# EAGLE design ionode (EAGLE 7.3.0)
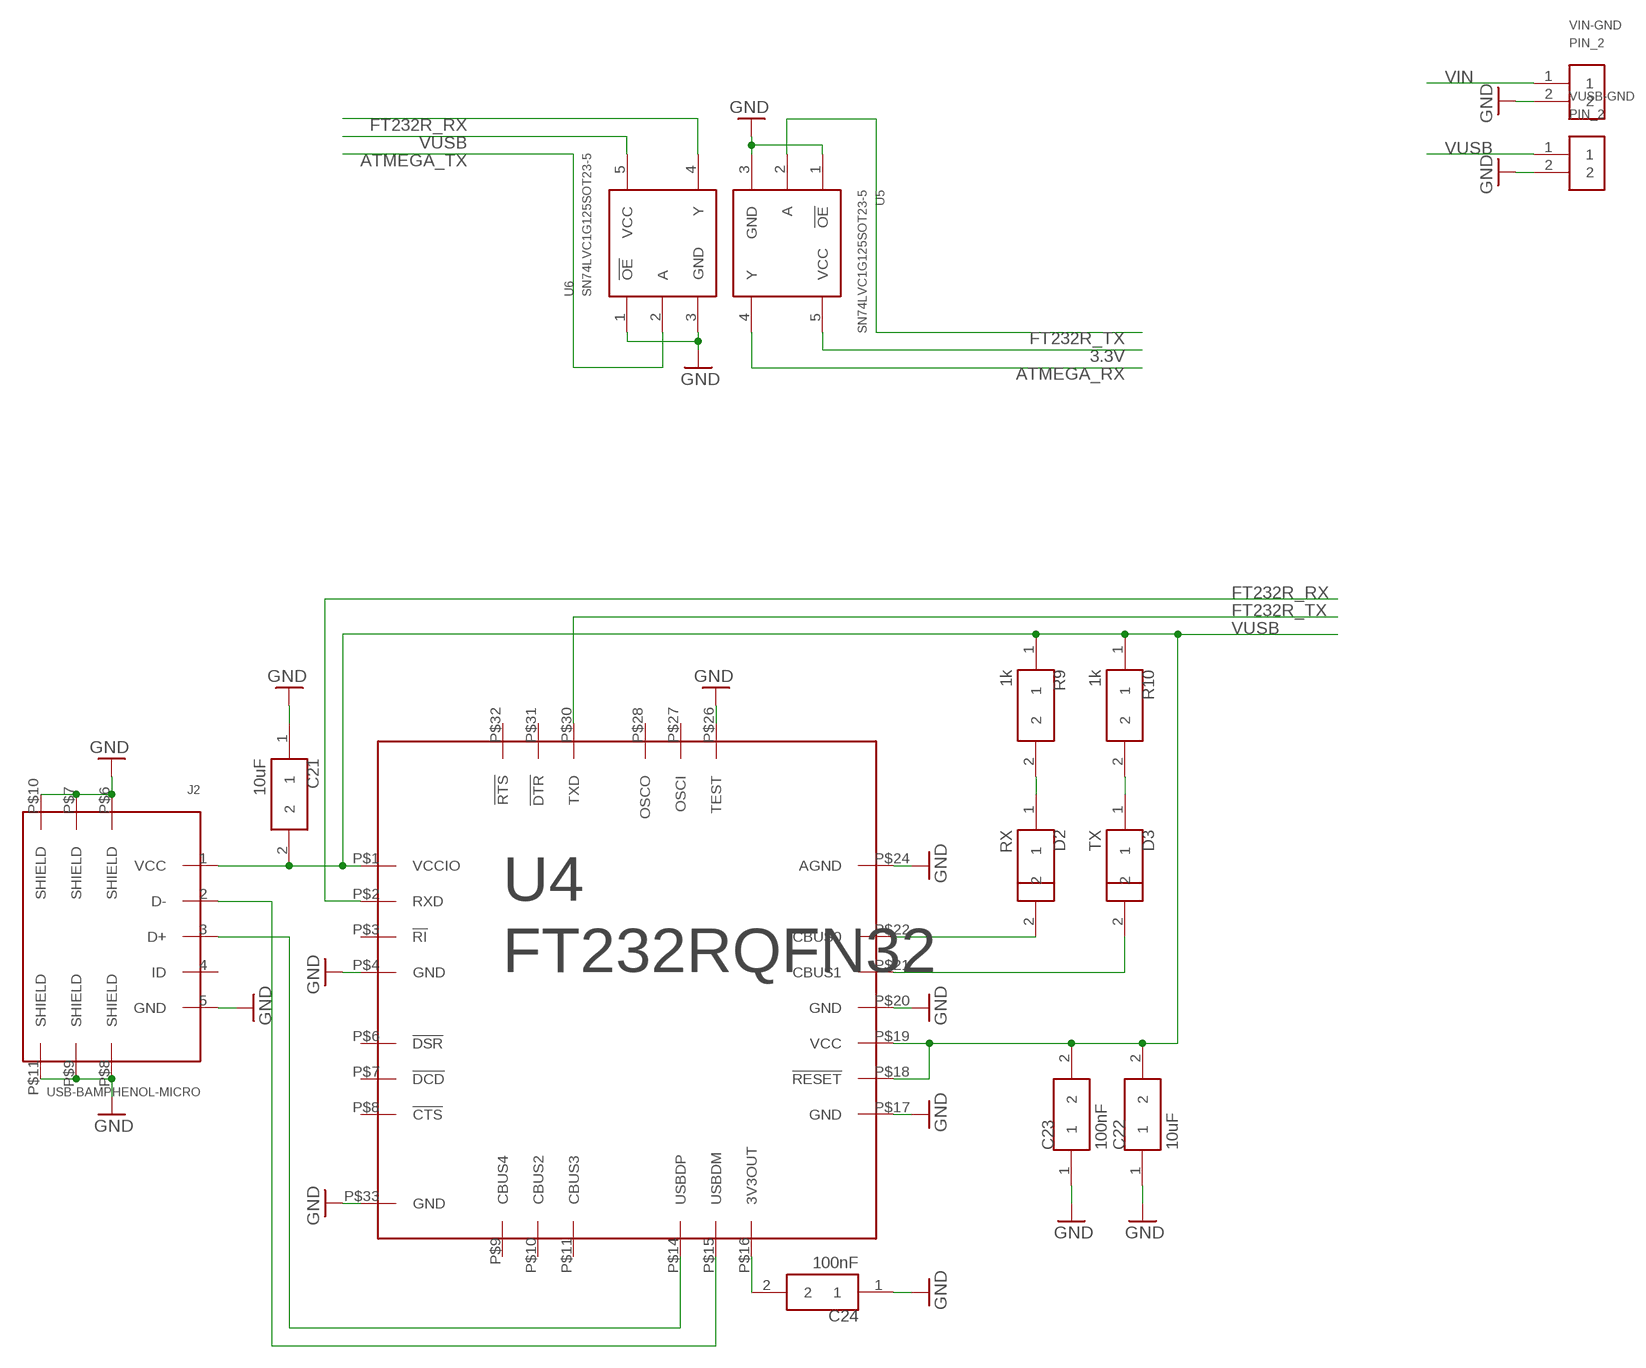
[diagram p0: schematic, sheet 1, part 1 of 2]
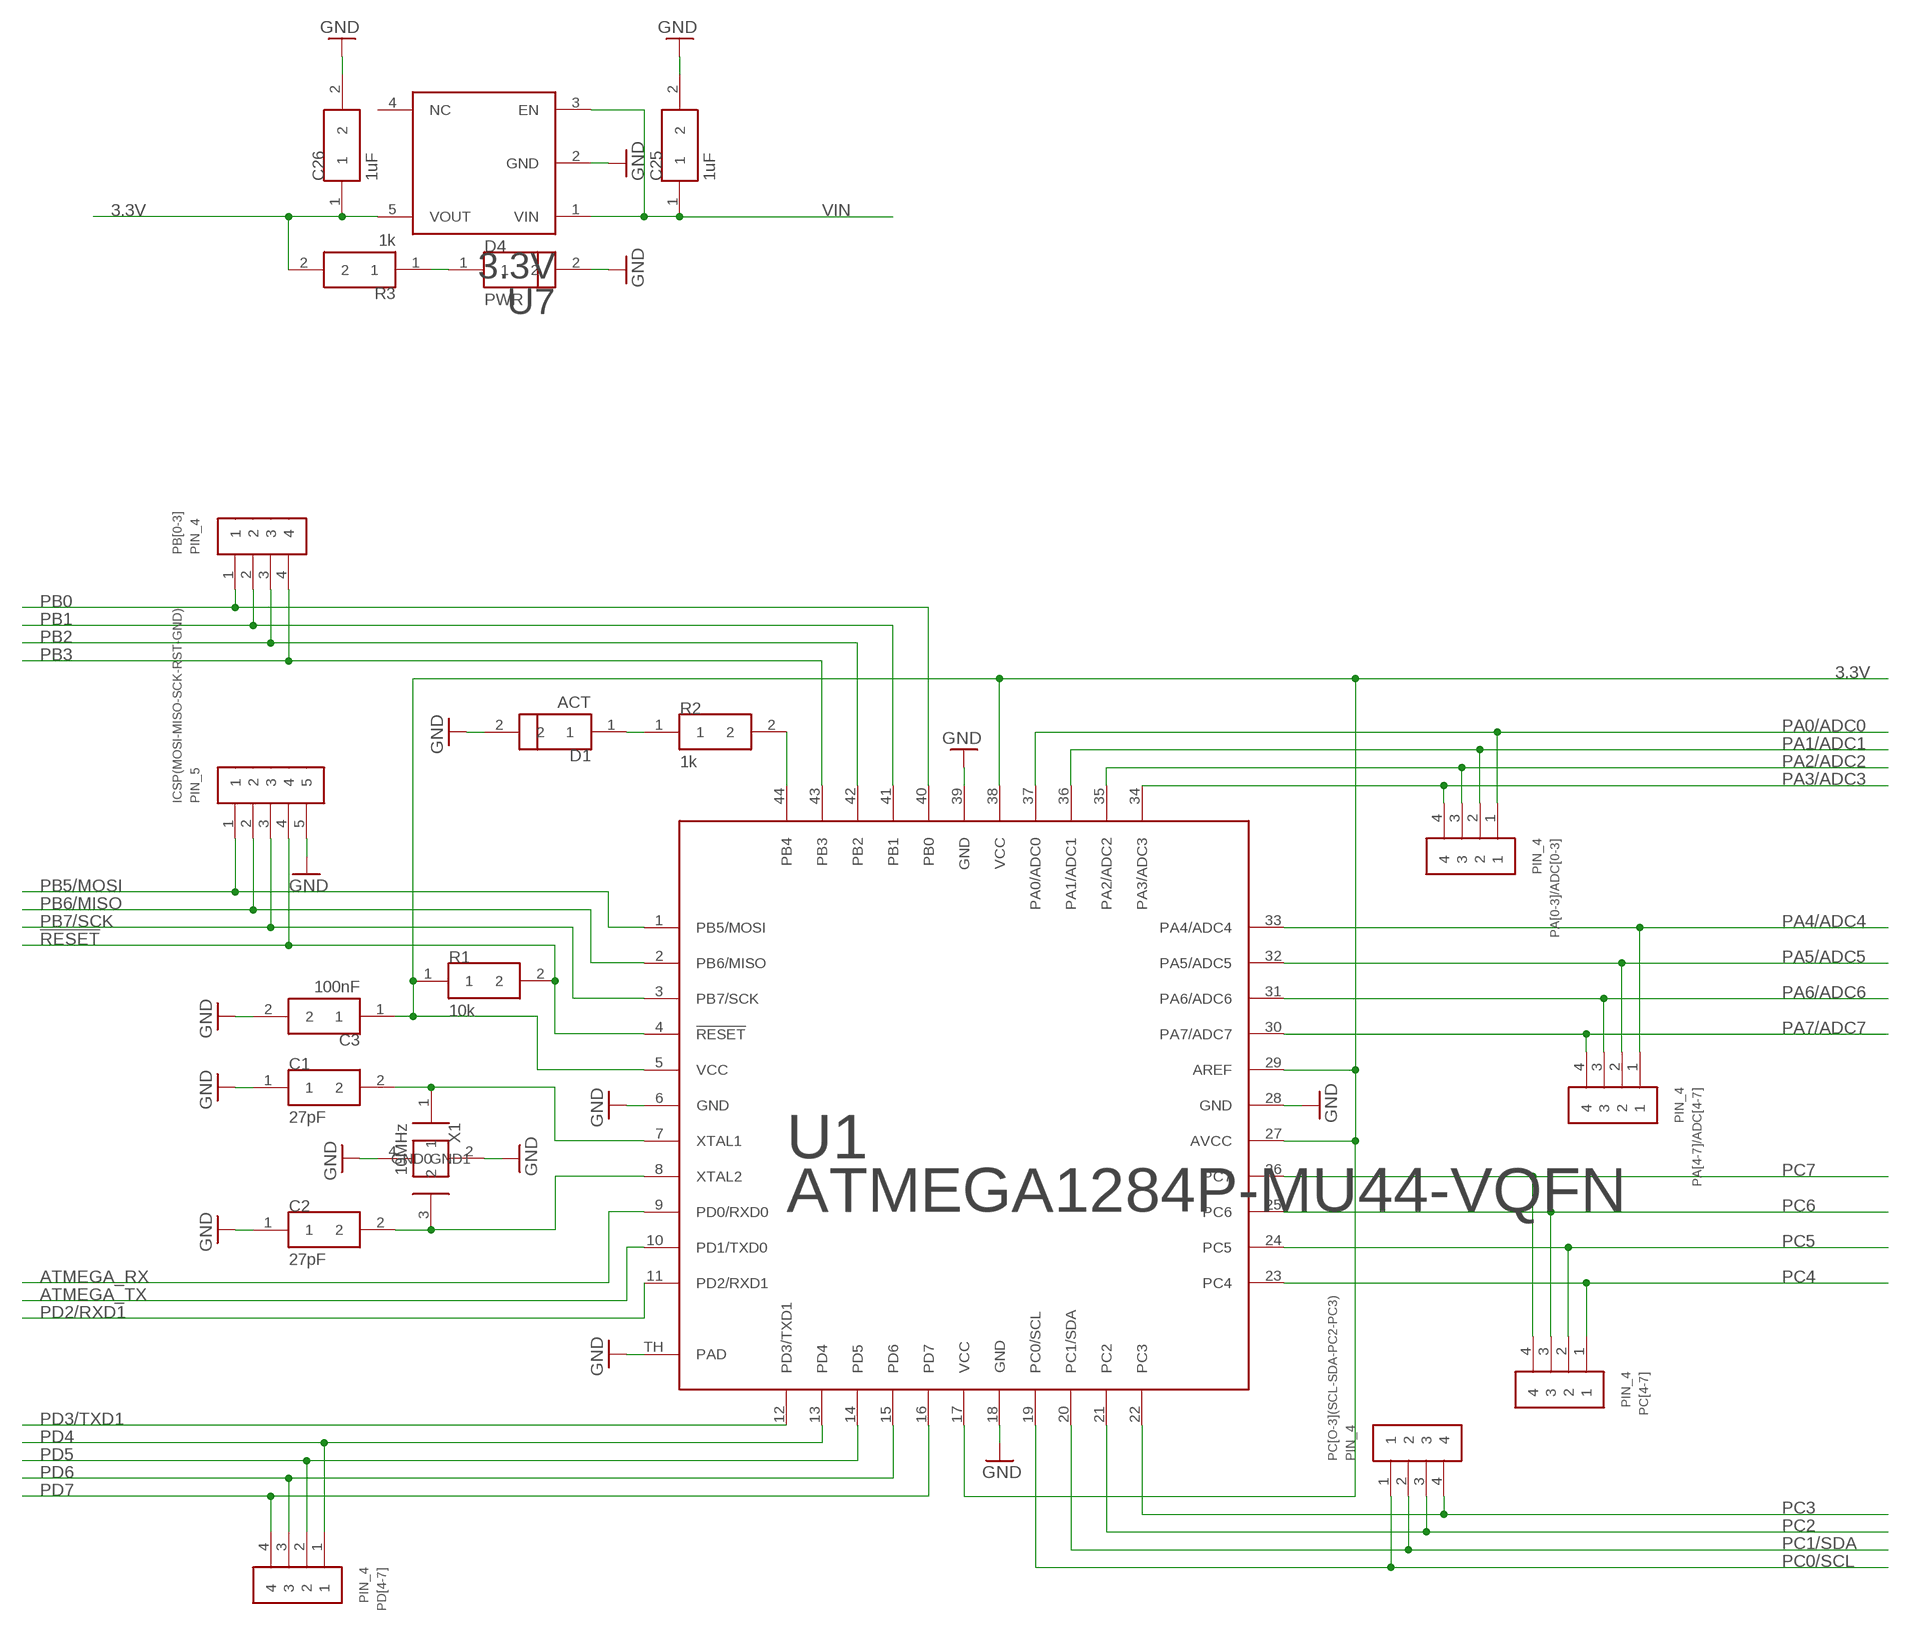
[diagram p1: schematic, sheet 1, part 2 of 2]

## Parts
C1  27pF  CAP0805  [0805]
C2  27pF  CAP0805  [0805]
C3  100nF  CAP0805  [0805]
C21  10uF  CAP0805  [0805]
C22  10uF  CAP0805  [0805]
C23  100nF  CAP0805  [0805]
C24  100nF  CAP0805  [0805]
C25  1uF  CAP0805  [0805]
C26  1uF  CAP0805  [0805]
D1  ACT  LED0805  [0805]
D2  RX  LED0805  [0805]
D3  TX  LED0805  [0805]
D4  PWR  LED0805  [0805]
ICSP(MOSI-MISO-SCK-RST-GND)  PIN_5  [PIN_5]
J2  USB-BAMPHENOL-MICRO  [AMPHENOL-USB-MICRO-B]
PA[0-3]/ADC[0-3]  PIN_4  [PIN_4]
PA[4-7]/ADC[4-7]  PIN_4  [PIN_4]
PB[0-3]  PIN_4  [PIN_4]
PC[4-7]  PIN_4  [PIN_4]
PC[O-3](SCL-SDA-PC2-PC3)  PIN_4  [PIN_4]
PD[4-7]  PIN_4  [PIN_4]
R1  10k  RES0805  [0805]
R2  1k  RES0805  [0805]
R3  1k  RES0805  [0805]
R9  1k  RES0805  [0805]
R10  1k  RES0805  [0805]
U1  ATMEGA1284P-MU44-VQFN  [44-VQFN]
U4  FT232RQFN32  [32-VQFN]
U5  SN74LVC1G125SOT23-5  [SOT23-5]
U6  SN74LVC1G125SOT23-5  [SOT23-5]
U7  3.3V  LP3985SOT23-5  [SOT23-5]
VIN-GND  PIN_2  [PIN_2]
VUSB-GND  PIN_2  [PIN_2]
X1  10MHz  XTAL_GNDSMD_3225  [XTAL_3225]

## Nets
3.3V: C3.1 C26.1 R1.1 R3.2 U1.5(VCC) U1.17(VCC) U1.27(AVCC) U1.29(AREF) U1.38(VCC) U5.5(VCC) U7.5(VOUT)
!RESET: ICSP(MOSI-MISO-SCK-RST-GND).4 R1.2 U1.4(!RESET)
ATMEGA_RX: U1.9(PD0/RXD0) U5.4(Y)
ATMEGA_TX: U1.10(PD1/TXD0) U6.2(A)
FT232R_RX: U4.P$2(RXD) U6.4(Y)
FT232R_TX: U4.P$30(TXD) U5.2(A)
GND: C1.1 C2.1 C3.2 C21.1 C22.1 C23.1 C24.1 C25.2 C26.2 D1.2 D4.2 ICSP(MOSI-MISO-SCK-RST-GND).5 J2.5(GND) J2.P$6(SHIELD) J2.P$7(SHIELD) J2.P$8(SHIELD) J2.P$9(SHIELD) J2.P$10(SHIELD) J2.P$11(SHIELD) U1.6(GND) U1.18(GND) U1.28(GND) U1.39(GND) U1.TH(PAD) U4.P$4(GND) U4.P$17(GND) U4.P$20(GND) U4.P$24(AGND) U4.P$26(TEST) U4.P$33(GND) U5.1(!OE) U5.3(GND) U6.1(!OE) U6.3(GND) U7.2(GND) VIN-GND.2 VUSB-GND.2 X1.2(GND0) X1.4(GND1)
N$1: C2.2 U1.8(XTAL2) X1.3
N$2: C1.2 U1.7(XTAL1) X1.1
N$3: D4.1 R3.1
N$5: D1.1 R2.1
N$6: R2.2 U1.44(PB4)
N$21: C24.2 U4.P$16(3V3OUT)
N$22: D2.2 U4.P$22(CBUS0)
N$23: D3.2 U4.P$21(CBUS1)
N$24: D2.1 R9.2
N$25: D3.1 R10.2
N$26: J2.2(D-) U4.P$15(USBDM)
N$27: J2.3(D+) U4.P$14(USBDP)
PA0/ADC0: PA[0-3]/ADC[0-3].1 U1.37(PA0/ADC0)
PA1/ADC1: PA[0-3]/ADC[0-3].2 U1.36(PA1/ADC1)
PA2/ADC2: PA[0-3]/ADC[0-3].3 U1.35(PA2/ADC2)
PA3/ADC3: PA[0-3]/ADC[0-3].4 U1.34(PA3/ADC3)
PA4/ADC4: PA[4-7]/ADC[4-7].1 U1.33(PA4/ADC4)
PA5/ADC5: PA[4-7]/ADC[4-7].2 U1.32(PA5/ADC5)
PA6/ADC6: PA[4-7]/ADC[4-7].3 U1.31(PA6/ADC6)
PA7/ADC7: PA[4-7]/ADC[4-7].4 U1.30(PA7/ADC7)
PB0: PB[0-3].1 U1.40(PB0)
PB1: PB[0-3].2 U1.41(PB1)
PB2: PB[0-3].3 U1.42(PB2)
PB3: PB[0-3].4 U1.43(PB3)
PB5/MOSI: ICSP(MOSI-MISO-SCK-RST-GND).1 U1.1(PB5/MOSI)
PB6/MISO: ICSP(MOSI-MISO-SCK-RST-GND).2 U1.2(PB6/MISO)
PB7/SCK: ICSP(MOSI-MISO-SCK-RST-GND).3 U1.3(PB7/SCK)
PC0/SCL: PC[O-3](SCL-SDA-PC2-PC3).1 U1.19(PC0/SCL)
PC1/SDA: PC[O-3](SCL-SDA-PC2-PC3).2 U1.20(PC1/SDA)
PC2: PC[O-3](SCL-SDA-PC2-PC3).3 U1.21(PC2)
PC3: PC[O-3](SCL-SDA-PC2-PC3).4 U1.22(PC3)
PC4: PC[4-7].1 U1.23(PC4)
PC5: PC[4-7].2 U1.24(PC5)
PC6: PC[4-7].3 U1.25(PC6)
PC7: PC[4-7].4 U1.26(PC7)
PD2/RXD1: U1.11(PD2/RXD1)
PD3/TXD1: U1.12(PD3/TXD1)
PD4: PD[4-7].1 U1.13(PD4)
PD5: PD[4-7].2 U1.14(PD5)
PD6: PD[4-7].3 U1.15(PD6)
PD7: PD[4-7].4 U1.16(PD7)
VIN: C25.1 U7.1(VIN) U7.3(EN) VIN-GND.1
VUSB: C21.2 C22.2 C23.2 J2.1(VCC) R9.1 R10.1 U4.P$1(VCCIO) U4.P$18(!RESET) U4.P$19(VCC) U6.5(VCC) VUSB-GND.1
Unconnected: J2.4(ID) U4.P$3(!RI) U4.P$6(!DSR) U4.P$7(!DCD) U4.P$8(!CTS) U4.P$9(CBUS4) U4.P$10(CBUS2) U4.P$11(CBUS3) U4.P$27(OSCI) U4.P$28(OSCO) U4.P$31(!DTR) U4.P$32(!RTS) U7.4(NC)

## Library data of the parts
C1-C3 C21-C26 = dooba:CAP
D1-D4 = dooba:LED
ICSP(MOSI-MISO-SCK-RST-GND) = dooba:PIN_5
J2 = dooba:USB-B
PA[0-3]/ADC[0-3] PA[4-7]/ADC[4-7] PB[0-3] PC[4-7] PC[O-3](SCL-SDA-PC2-PC3) PD[4-7] = dooba:PIN_4
R1-R3 R9 R10 = dooba:RES
U1 = dooba:ATMEGA1284P-MU
U4 = dooba:FT232R
U5 U6 = dooba:SN74LVC1G125
U7 = dooba:LP3985
VIN-GND VUSB-GND = dooba:PIN_2
X1 = dooba:XTAL_GND

## Board
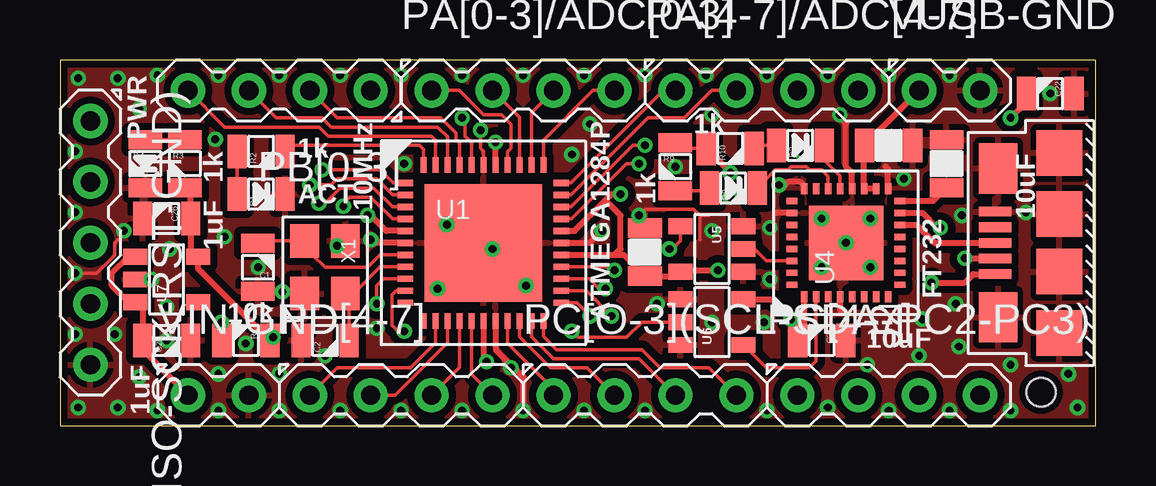
[diagram p2: board, top side]
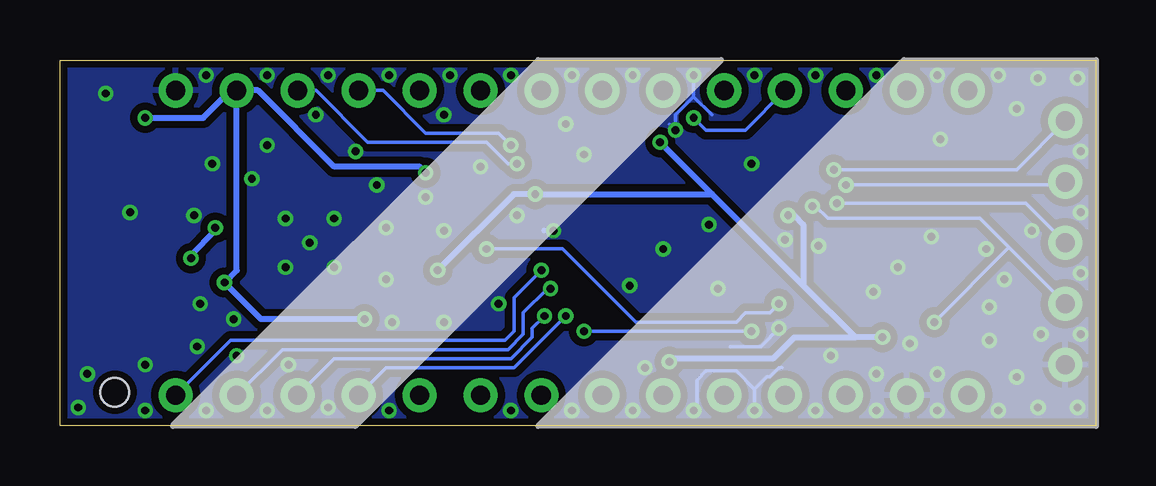
[diagram p3: board, bottom side, seen from below]

Size 43.18 x 15.24 mm. Coordinates in mm from the lower left corner, seen from the top.
Outline: 0,15.24 0,0 43.18,0 43.18,15.24 0,15.24
Copper layers (1*16): Top 0.035mm / dielectric 1.5mm / Bottom 0.035mm
Design rules "dooba": minimum track width 6mil, minimum drill 12mil, track to track 6mil, track to pad 6mil, pad to pad 6mil, via to via 6mil, smd to smd 0mil, copper to edge 10mil, drill to drill 10mil, minimum pad ring 10mil, minimum via ring 6mil, stop-mask expansion 2mil, vias tented up to drill 25mil, thermal gap 10mil
Holes 1.2 mm at 40.89,1.4

### Footprints (pad centres in the part's own frame; a part is rotated, then mirrored left to right if it is on the bottom)
0805 = smd 0.8 x 1.4: 1 -1,0; 2 1,0
PIN_5 = drill 0.8 pad 1.422: 1 -5.08,0; 2 -2.54,0; 3 0,0; 4 2.54,0; 5 5.08,0
AMPHENOL-USB-MICRO-B = smd 0.4 x 1.35: 1 -1.3,2.675; 2 -0.65,2.675; 3 0,2.675; 4 0.65,2.675; 5 1.3,2.675 | smd 1.9 x 1.9: P$6 -1.2,0; P$7 1.2,0; P$8 -3.75,0; P$9 3.75,0 | smd 2.1 x 1.6: P$10 -3.1,2.55; P$11 3.1,2.55
PIN_4 = drill 0.8 pad 1.422: 1 -3.81,0; 2 -1.27,0; 3 1.27,0; 4 3.81,0
44-VQFN = smd 0.65 x 0.26: 1 -3.25,2.5; 2 -3.25,2; 3 -3.25,1.5; 4 -3.25,1; 5 -3.25,0.5; 6 -3.25,0; 7 -3.25,-0.5; 8 -3.25,-1; 9 -3.25,-1.5; 10 -3.25,-2; 11 -3.25,-2.5; 23 3.25,-2.5; 24 3.25,-2; 25 3.25,-1.5; 26 3.25,-1; 27 3.25,-0.5; 28 3.25,0; 29 3.25,0.5; 30 3.25,1; 31 3.25,1.5; 32 3.25,2; 33 3.25,2.5 | smd 0.26 x 0.65: 12 -2.5,-3.25; 13 -2,-3.25; 14 -1.5,-3.25; 15 -1,-3.25; 16 -0.5,-3.25; 17 0,-3.25; 18 0.5,-3.25; 19 1,-3.25; 20 1.5,-3.25; 21 2,-3.25; 22 2.5,-3.25; 34 2.5,3.25; 35 2,3.25; 36 1.5,3.25; 37 1,3.25; 38 0.5,3.25; 39 0,3.25; 40 -0.5,3.25; 41 -1,3.25; 42 -1.5,3.25; 43 -2,3.25; 44 -2.5,3.25 | smd 4.9 x 4.9: TH 0,0
32-VQFN = smd 0.45 x 0.26: P$1 -2.25,1.75; P$2 -2.25,1.25; P$3 -2.25,0.75; P$4 -2.25,0.25; P$5 -2.25,-0.25; P$6 -2.25,-0.75; P$7 -2.25,-1.25; P$8 -2.25,-1.75; P$17 2.25,-1.75; P$18 2.25,-1.25; P$19 2.25,-0.75; P$20 2.25,-0.25; P$21 2.25,0.25; P$22 2.25,0.75; P$23 2.25,1.25; P$24 2.25,1.75 | smd 0.26 x 0.45: P$9 -1.75,-2.25; P$10 -1.25,-2.25; P$11 -0.75,-2.25; P$12 -0.25,-2.25; P$13 0.25,-2.25; P$14 0.75,-2.25; P$15 1.25,-2.25; P$16 1.75,-2.25; P$25 1.75,2.25; P$26 1.25,2.25; P$27 0.75,2.25; P$28 0.25,2.25; P$29 -0.25,2.25; P$30 -0.75,2.25; P$31 -1.25,2.25; P$32 -1.75,2.25 | smd 3.1 x 3.1: P$33 0,0
SOT23-5 = smd 0.66 x 1: 1 0.95,1.315; 2 0,1.315; 3 -0.95,1.315; 4 -0.95,-1.315; 5 0.95,-1.315
PIN_2 = drill 0.8 pad 1.422: 1 -1.27,0; 2 1.27,0
XTAL_3225 = smd 1.4 x 1.2: 1 -1.1,-0.85; 2 1.1,-0.85; 3 1.1,0.85; 4 -1.1,0.85

### Placement (x,y rotation side)
C1  8.25,6.6 90 top
C2  11.05,3.56 0 top
C3  24.38,7.24 90 top
C21  31.75,3.56 180 top
C22  41.27,13.84 180 top
C23  34.54,11.68 180 top
C24  36.96,10.92 270 top
C25  4.45,3.56 0 top
C26  4.45,8.64 180 top
D1  8.38,9.65 0 top
D2  28.07,9.91 0 top
D3  30.86,11.68 0 top
D4  3.56,10.92 270 top
ICSP(MOSI-MISO-SCK-RST-GND)  1.27,7.62 270 top
J2  41.66,7.62 90 top
PA[0-3]/ADC[0-3]  19.3,13.97 0 top
PA[4-7]/ADC[4-7]  29.46,13.97 0 top
PB[0-3]  9.14,13.97 180 top
PC[4-7]  34.54,1.27 0 top
PC[O-3](SCL-SDA-PC2-PC3)  24.38,1.27 0 top
PD[4-7]  14.22,1.27 0 top
R1  7.75,3.56 180 top
R2  8.38,11.43 0 top
R3  5.21,10.92 270 top
R9  25.65,10.8 270 top
R10  27.94,11.56 0 top
U1  17.65,7.62 0 top
U4  32.77,7.62 90 top
U5  27.18,7.37 270 top
U6  27.18,4.32 90 top
U7  4.45,6.1 90 top
VIN-GND  6.6,1.27 0 top
VUSB-GND  37.08,13.97 0 top
X1  11.05,6.6 270 top

### Tracks (layer width: path | path; a pad name or v marks a point on that pad's centre or on a via)
3.3V  (via drill 0.33)
  Top 0.254: U1.38 v18.15,11.8 v18.16,11.81 | R3.2 5.45,9.68 C26.1 5.45,7.36 U7.5 5.76,6.54 R1.1 8.87,3.68 v8.89,3.68 | U1.5 13.6,8.12 12.95,8.76 v12.83,8.76 | U1.17 17.65,2.79 v17.78,2.67 | U1.27 23.12,7.12 | 23.12,7.12 23.5,7.12 C3.1 25.69,6.24 U5.5 25.92,6.48 v27.43,6.48 27.49,6.42 | U1.29 21.46,8.12 22.73,9.4 | 22.73,9.4 22.99,9.65 v23.37,9.65 | 23.12,7.12 23.37,7.37 23.37,8.76 22.73,9.4
  Bottom 0.254: v8.89,3.68 10.03,3.68 | 10.03,3.68 12.19,5.84 | 12.19,5.84 16,9.65 | 16,9.65 v18.16,11.81 | v12.83,8.76 12.57,8.76 12.19,8.38 12.19,5.84 | 10.03,3.68 12.57,3.68 13.46,2.79 17.65,2.79 v17.78,2.67 | v27.43,6.48 24.26,9.65 v23.37,9.65 16,9.65
!RESET  (via drill 0.33)
  Top 0.152: U1.4 13.86,8.62 12.95,9.52 12.07,9.52 11.81,9.27 v11.81,9.14 | R1.2 6.73,3.57 v6.73,4.32
  Bottom 0.152: v11.81,9.14 11.68,9.14 11.18,8.64 4.83,8.64 3.62,7.43 | 3.62,7.43 ICSP(MOSI-MISO-SCK-RST-GND).4 | v6.73,4.32 3.62,7.43
ATMEGA_RX  (via drill 0.33)
  Top 0.152: U5.4 25.86,7.7 25.53,7.37 v25.4,7.37 | v13.21,5.08 13.21,5.84 13.49,6.12 U1.9
  Bottom 0.152: v25.4,7.37 22.22,7.37 19.18,4.32 14.99,4.32 14.61,4.7 13.59,4.7 v13.21,5.08
ATMEGA_TX  (via drill 0.33)
  Top 0.152: U6.2 24.26,4.32 23.62,3.68 21.59,3.68 v21.34,3.94 | v14.35,3.94 14.1,3.94 13.84,4.19 13.84,5.46 14,5.62 U1.10
  Bottom 0.152: v21.34,3.94 v14.35,3.94
FT232R_RX
  Top 0.152: U4.P$2 31.52,2.69 31.24,2.41 29.45,2.41 U6.4
FT232R_TX
  Top 0.152: U4.P$30 29.45,6.87 28.96,7.37 U5.2
GND  (via drill 0.33)
  Top 0.152: U1.39 17.65,11.43 17.53,11.56 v17.53,12.32 | v0.63,6.35 1.52,6.35 2.29,7.11 2.29,7.62 2.41,7.75 | v24.13,8.76 24.38,9.02 26.42,9.02 26.67,8.76 | 27.05,8.76 26.67,8.76 | 26.67,8.76 26.67,7.75
  Top 0.254: U4.P$17 34.52,10.7 34.42,10.8 | U4.P$20 33.02,10.55 32.77,10.8 32.77,12.57 32.51,12.83 | U4.P$24 31.02,10.01 30.86,10.16 30.35,10.16 30.23,10.03 | U4.P$26 29.86,8.87 29.84,8.89 | U4.P$4 32.52,4.82 32.64,4.7 | U1.6 12.95,7.62 | U1.18 18.16,3.18 19.3,2.03 v19.3,0.64 | U1.28 22.1,7.62 v22.61,8.13
  Bottom 0.152: 17.78,12.57 v17.53,12.32 17.53,12.95 16.76,13.72 | 14.22,1.52 13.72,2.03 13.59,2.03 13.21,2.41 13.08,2.41 | 16.76,13.72 16,12.95 | v16.76,14.61 16.76,13.72 | v14.22,0.64 14.22,1.52 | 14.22,1.52 14.99,2.29 16.26,2.29 16.64,1.91 16.64,0.76 v16.76,0.64 | v13.21,4.06 13.97,3.3 15.24,3.3
  Bottom 0.254: v19.3,0.64 19.3,0.51 | v22.61,8.13 22.99,8.13
  other vias: 18.8,2.41 19.43,5.84 15.75,5.71 16.13,8.38 18.03,7.37 12.95,7.75 11.56,7.49 14.35,10.92 21.34,11.3 21.84,14.61 19.3,14.61 14.22,14.61 11.68,14.61 9.14,14.61 6.6,14.61 4.06,14.61 0.76,14.48 0.76,0.76 4.06,0.64 6.6,0.64 9.14,0.64 11.68,0.64 21.84,0.64 24.38,0.64 24.38,14.61 26.92,14.61 29.46,0.64 29.46,14.61 32,14.61 32,0.76 34.54,0.64 37.08,0.64 37.08,14.61 34.54,14.61 41.27,13.84 42.42,0.76 39.62,0.64 39.62,2.54 42.04,2.16 40.26,8.89 36.83,10.92 37.34,5.08 35.94,4.45 37.47,3.3 37.59,8.76 35.18,10.29 34.54,11.68 33.78,8.64 33.78,6.6 31.75,6.6 31.75,8.64 32.77,7.62 35.81,2.92 33.66,2.54 32.51,12.95 30.86,11.43 29.59,8.26 27.94,9.52 27.18,12.95 22.1,12.57 27.18,8.13 27.18,4.32 29.34,4.32 29.59,6.1 24.89,5.08 3.3,13.21 2.41,14.48 2.41,0.76 3.3,2.03 6.6,2.16 9.14,2.16 6.48,11.94 6.86,7.87 8.25,6.6 9.27,5.59 11.05,2.92 0.63,11.43 0.63,8.89 0.63,3.81 2.29,3.81 4.45,4.95 4.45,3.56 4.57,7.37 2.67,8.13 7.75,3.43 3.81,6.1 29.97,10.03 25.65,10.8
  pour Top (isolate 0.305): 43.18,15.24 43.18,0 0,0 0,15.24
  pour Bottom (isolate 0.305): 43.18,15.24 43.18,0 0,0 0,15.24
N$1
  Top 0.152: U1.8 13.35,6.62 12.32,5.59 11.98,5.59 X1.3 12.05,5.35 C2.2
N$2
  Top 0.152: U1.7 13.34,7.12 12.83,6.6 11.05,6.6 10.54,7.11 10.54,7.36 X1.1 8.36,7.7 C1.2
N$3
  Top 0.152: R3.1 D4.1
N$5
  Top 0.152: R2.1 D1.1
N$6
  Top 0.152: U1.44 15.15,11.52 14.99,11.68 9.64,11.68 R2.2
N$21
  Top 0.254: U4.P$16 36.41,9.37 C24.2
N$22
  Top 0.152: 29.21,9.91 D2.2 29.83,10.67 30.35,10.67 30.48,10.8 31.11,10.8 31.24,10.67 31.75,10.67 32.02,10.4 U4.P$22
N$23
  Top 0.152: U4.P$21 32.52,10.41 31.88,11.05 31.88,11.67 D3.2
N$24
  Top 0.152: R9.2 26.83,9.8 D2.1
N$25
  Top 0.152: D3.1 29.07,11.68 R10.2
N$26  (via drill 0.33)
  Top 0.254: U4.P$15 35.96,8.87 36.58,8.26 v36.7,8.26 | v37.72,6.98 37.73,6.97 J2.2
  Bottom 0.254: v36.7,8.26 36.7,8.13 37.72,7.11 v37.72,6.98
N$27
  Top 0.254: U4.P$14 35.7,8.37 36.45,7.62 J2.3
PA0/ADC0
  Top 0.152: PA[0-3]/ADC[0-3].1 16.64,13.97 17.65,12.95 18.41,12.95 18.8,12.57 18.8,11.56 18.65,11.41 U1.37
PA1/ADC1
  Top 0.152: U1.36 19.15,12.85 PA[0-3]/ADC[0-3].2
PA2/ADC2
  Top 0.152: U1.35 19.65,13.05 PA[0-3]/ADC[0-3].3
PA3/ADC3
  Top 0.152: U1.34 20.15,11.9 22.22,13.97 PA[0-3]/ADC[0-3].4
PA4/ADC4
  Top 0.152: U1.33 21.3,10.12 25.15,13.97 PA[4-7]/ADC[4-7].1
PA5/ADC5
  Top 0.152: U1.32 21.3,9.62 24.51,12.83 26.04,12.83 27.18,13.97 PA[4-7]/ADC[4-7].2
PA6/ADC6  (via drill 0.33)
  Top 0.152: U1.31 21.31,9.12 23.88,11.68 v24.38,11.68
  Bottom 0.152: PA[4-7]/ADC[4-7].3 29.72,13.97 27.94,12.19 24.89,12.19 v24.38,11.68
PA7/ADC7  (via drill 0.33)
  Top 0.152: U1.30 21.32,8.62 23.62,10.92 v24.13,10.92
  Bottom 0.152: v24.13,10.92 24.51,10.92 25.4,11.81 30.35,11.81 32.51,13.97 PA[4-7]/ADC[4-7].4
PB0  (via drill 0.33)
  Top 0.152: U1.40 17.15,11.8 16.89,12.07 16.89,12.7 v16.76,12.83
  Bottom 0.152: PB[0-3].1 14.61,12.32 16.26,12.32 v16.76,12.83
PB1
  Top 0.152: PB[0-3].2 11.56,12.83 15.87,12.83 16.51,12.19 16.51,11.94 16.65,11.8 U1.41
PB2
  Top 0.152: U1.42 16.15,12.04 15.75,12.45 11.3,12.45 10.92,12.83 9.02,12.83 PB[0-3].3
PB3
  Top 0.152: U1.43 15.65,11.91 15.49,12.07 11.18,12.07 10.79,12.45 6.86,12.45 PB[0-3].4
PB5/MOSI  (via drill 0.33)
  Top 0.152: v10.92,10.67 13.33,10.67 13.88,10.12 U1.1
  Bottom 0.152: v10.92,10.67 3.3,10.67 ICSP(MOSI-MISO-SCK-RST-GND).1
PB6/MISO  (via drill 0.33)
  Top 0.152: v10.41,10.03 11.3,10.03 11.56,10.29 13.21,10.29 13.87,9.62 U1.2
  Bottom 0.152: v10.41,10.03 1.4,10.03 ICSP(MOSI-MISO-SCK-RST-GND).2
PB7/SCK  (via drill 0.33)
  Top 0.152: v10.79,9.27 11.05,9.27 11.68,9.91 13.08,9.91 13.87,9.12 U1.3
  Bottom 0.152: v10.79,9.27 2.92,9.27 ICSP(MOSI-MISO-SCK-RST-GND).3
PC0/SCL
  Top 0.152: PC[O-3](SCL-SDA-PC2-PC3).1 20.57,1.52 18.65,3.45 U1.19
PC1/SDA
  Top 0.152: U1.20 19.15,3.71 20.45,2.41 21.97,2.41 PC[O-3](SCL-SDA-PC2-PC3).2
PC2
  Top 0.152: U1.21 19.65,3.71 20.57,2.79 24.13,2.79 PC[O-3](SCL-SDA-PC2-PC3).3
PC3
  Top 0.152: U1.22 20.15,3.72 20.7,3.18 24.26,3.18 25.02,2.41 27.05,2.41 PC[O-3](SCL-SDA-PC2-PC3).4
PC4  (via drill 0.33)
  Top 0.152: U1.23 21.55,5.12 v22.1,4.57
  Bottom 0.152: v22.1,4.57 24.26,2.41 29.59,2.41 PC[4-7].1
PC5  (via drill 0.33)
  Top 0.152: U1.24 21.94,5.62 v22.99,4.57
  Bottom 0.152: v22.99,4.57 23.5,4.06 23.5,3.68 24.38,2.79 31.75,2.79 PC[4-7].2
PC6  (via drill 0.33)
  Top 0.152: U1.25 22.07,6.12 22.48,5.71 v22.73,5.71
  Bottom 0.152: v22.73,5.71 22.86,5.71 23.88,4.7 23.88,3.81 24.51,3.18 33.91,3.18 PC[4-7].3
PC7  (via drill 0.33)
  Top 0.152: U1.26 22.97,6.62 v23.11,6.48
  Bottom 0.152: v23.11,6.48 24.26,5.33 24.26,3.94 24.64,3.56 36.07,3.56 PC[4-7].4
PD4
  Top 0.152: U1.13 15.65,3.46 14.61,2.41 11.56,2.41 PD[4-7].1
PD5
  Top 0.152: U1.14 16.15,3.45 13.97,1.27 PD[4-7].2
PD6
  Top 0.152: U1.15 16.65,2.43 PD[4-7].3
PD7
  Top 0.152: U1.16 17.15,2.15 PD[4-7].4
VIN
  Top 0.254: U7.1 2.86,7.05 2.16,6.35 2.16,5.84 2.86,5.15 U7.3 3.45,4.83 C25.1 3.45,3.16 VIN-GND.1
VUSB  (via drill 0.33)
  Top 0.152: R10.1 25.89,11.56 R9.1
  Top 0.254: U4.P$18 U4.P$19 33.52,11.59 C23.2 33.53,11.68 VUSB-GND.1 | U4.P$1 31.02,3.82 C21.2 30.75,4.18 v30.48,4.45 29.66,5.27 U6.5 | v36.32,5.97 37.72,5.97 38.07,6.32 J2.1 | C22.2 40.26,13.83 40.26,13.46 v39.62,12.83 | R10.1 27.94,10.56 v27.94,10.54
  Bottom 0.254: v30.48,4.45 34.8,4.45 v36.32,5.97 35.81,6.48 VUSB-GND.1 | v39.62,12.83 37.21,12.83 36.07,13.97 VUSB-GND.1 | v27.94,10.54 28.19,10.8 31.75,10.8 34.92,13.97 VUSB-GND.1

### Text on the board
tPlace: PWR | 10MHz | ATMEGA1284P | 1k | 1k | 1k | 1k | 1uF | ACT | 10uF | FT232 | 10k | 10uF | 1uF